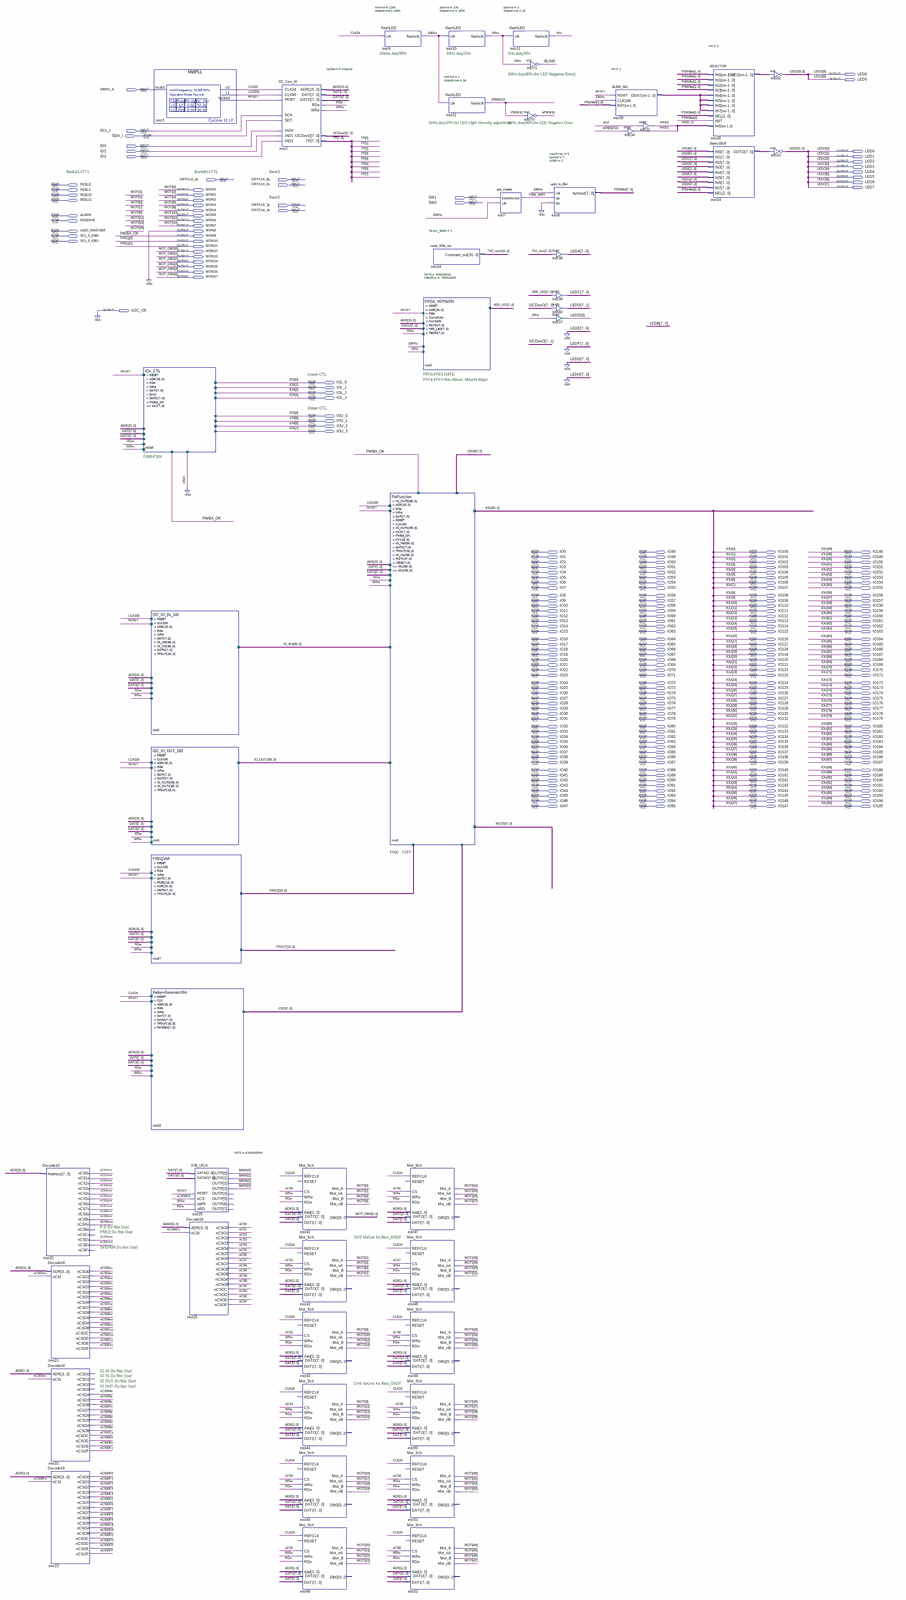
[diagram p0: schematic sheet, whole]
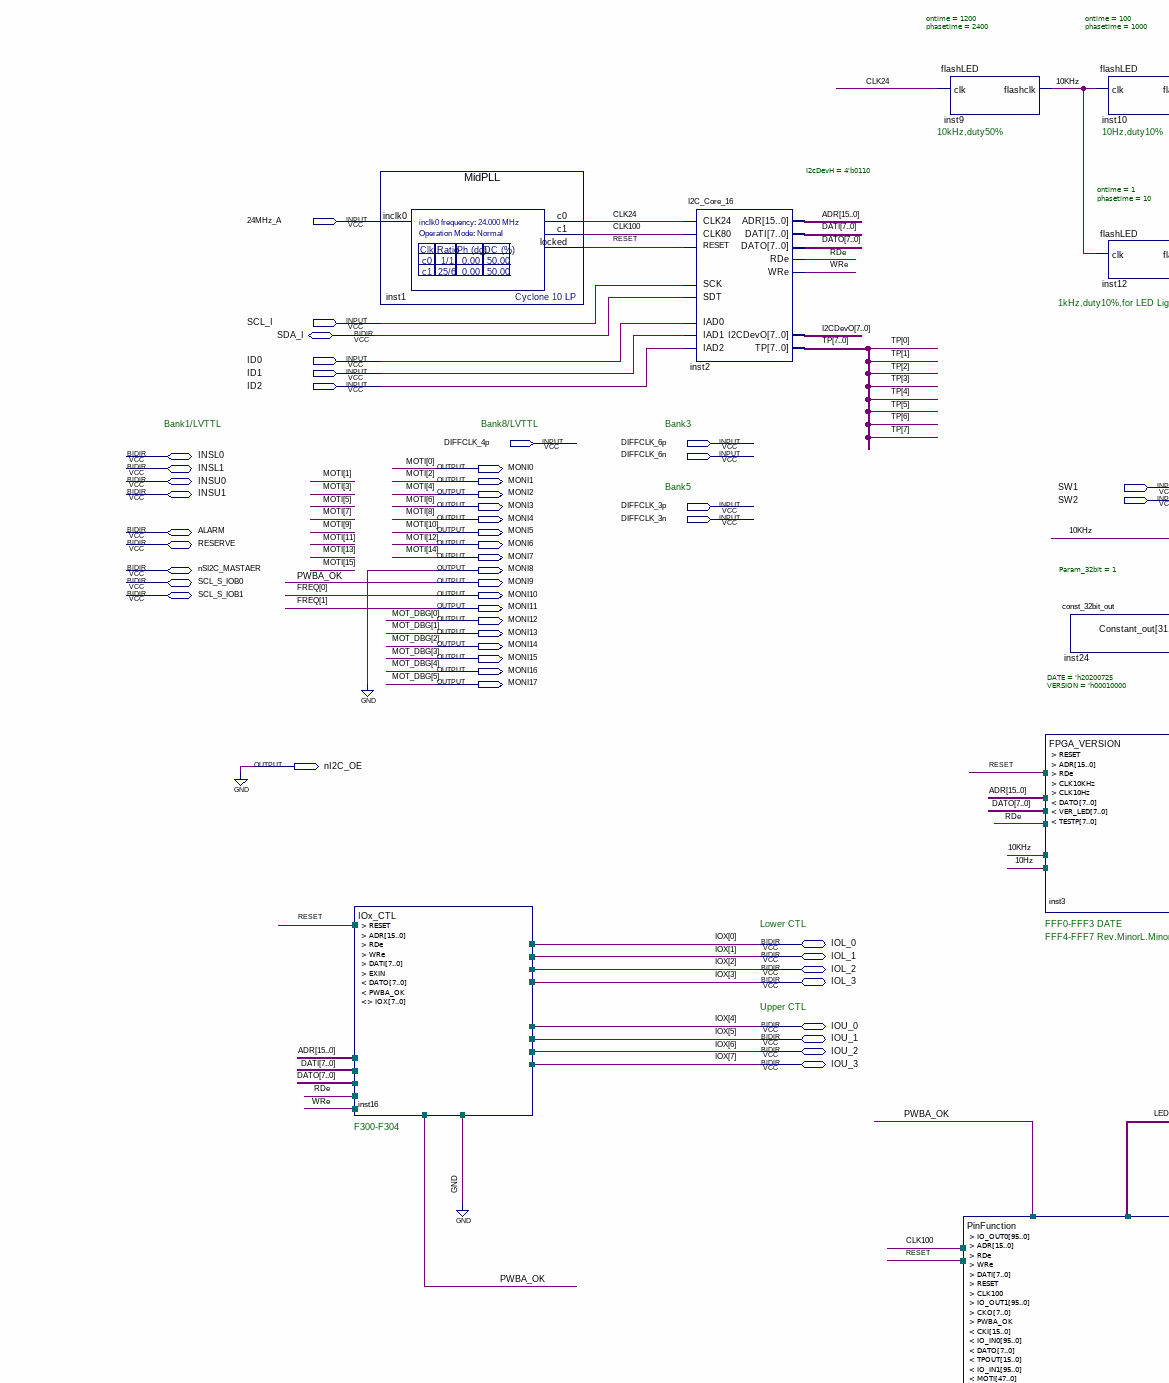
[diagram p1: schematic sheet, upper left part]
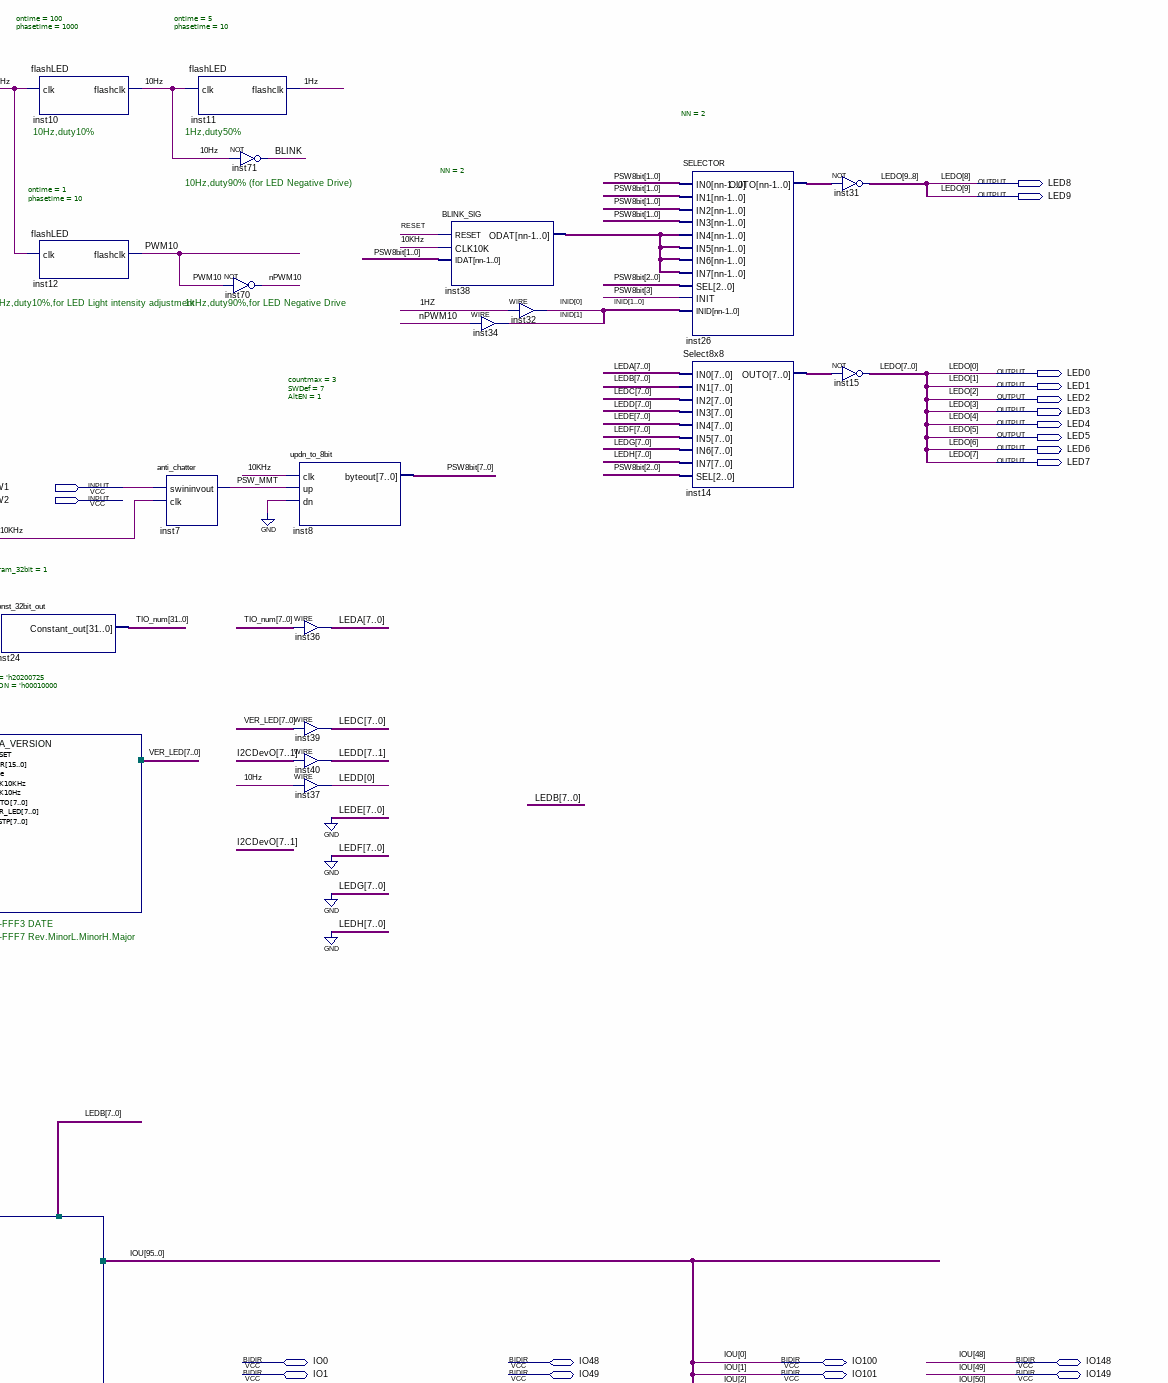
[diagram p2: schematic sheet, upper right part]
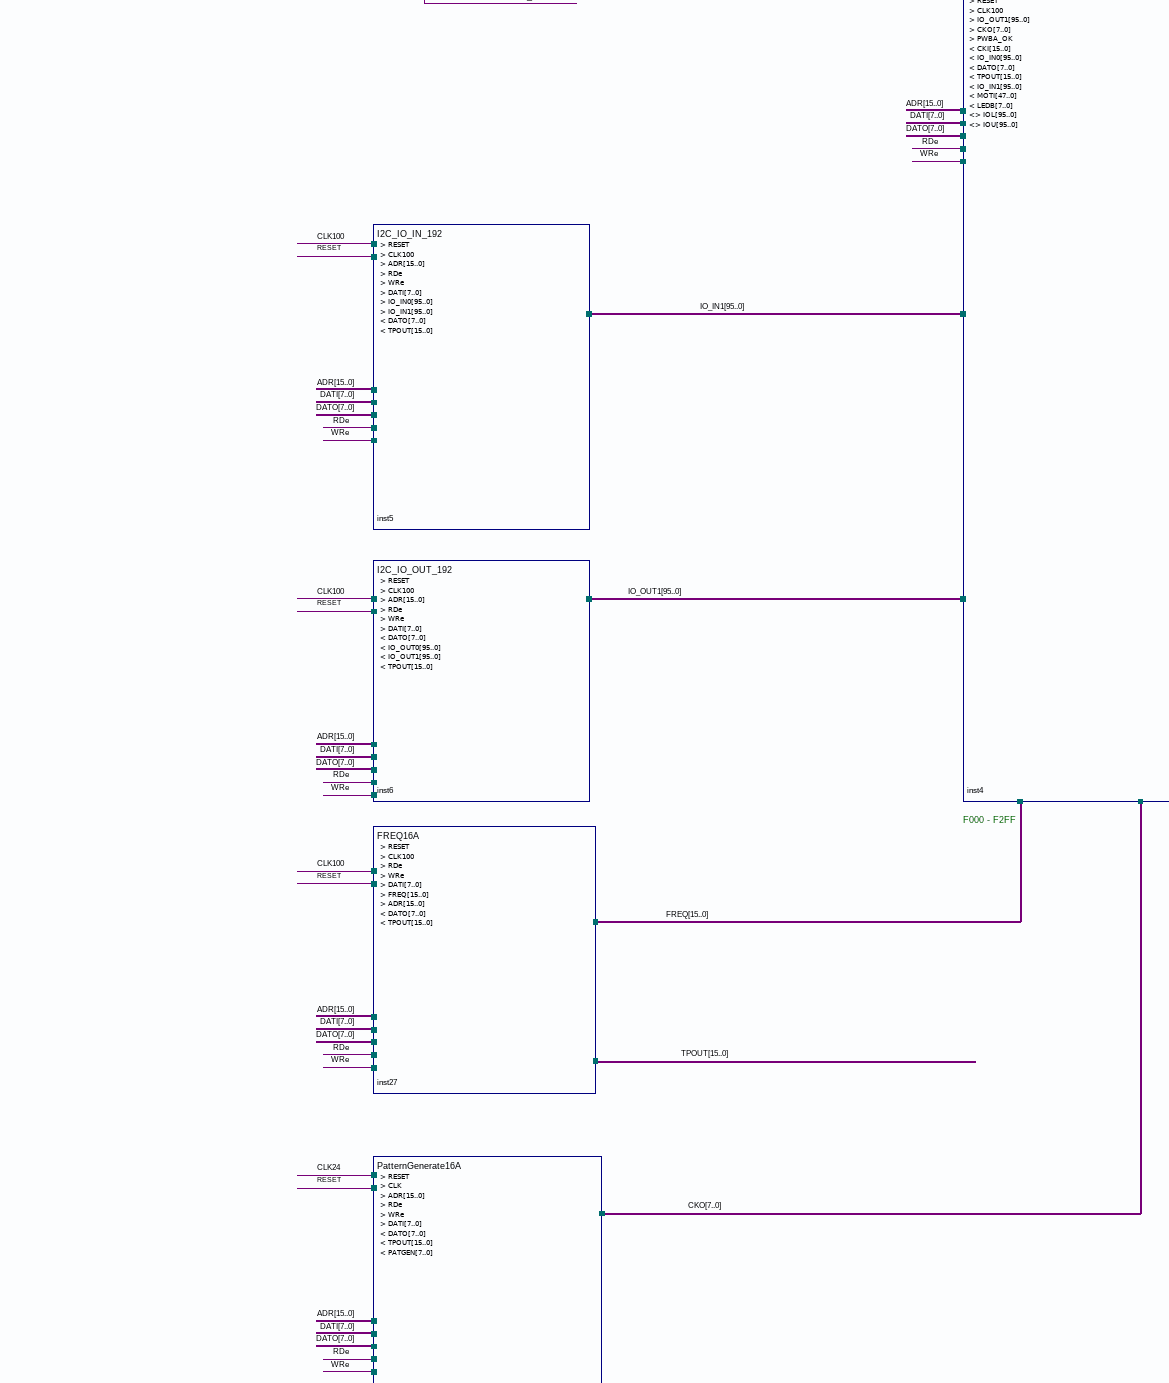
[diagram p3: schematic sheet, middle left part]
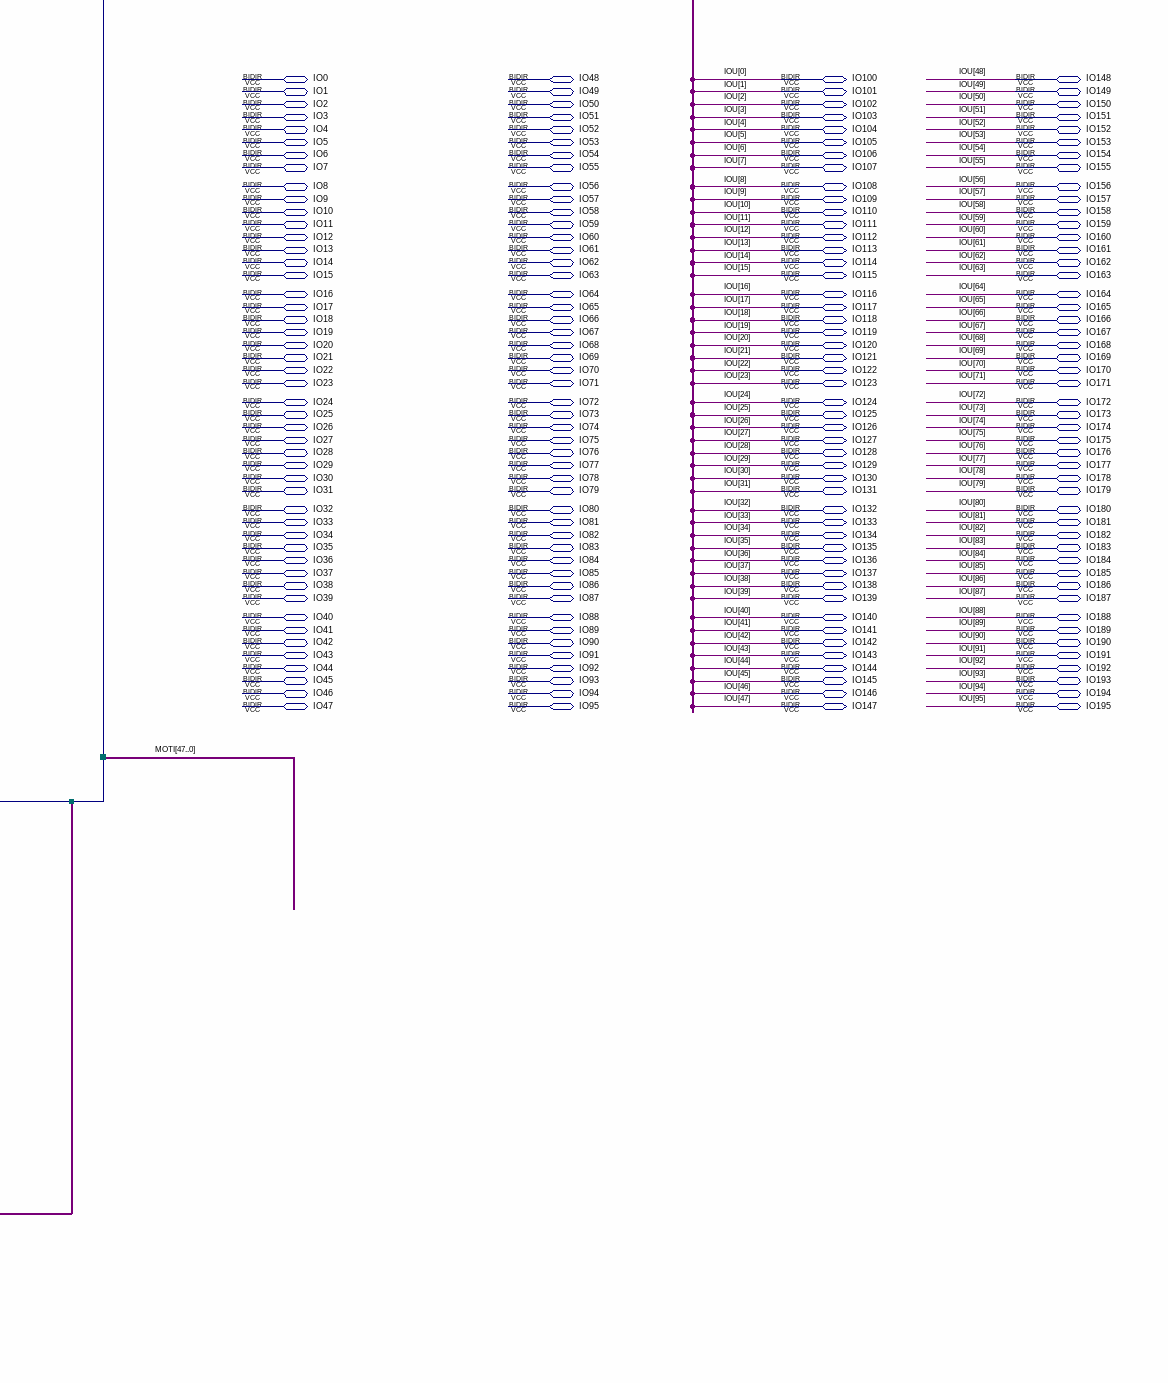
[diagram p4: schematic sheet, middle right part]
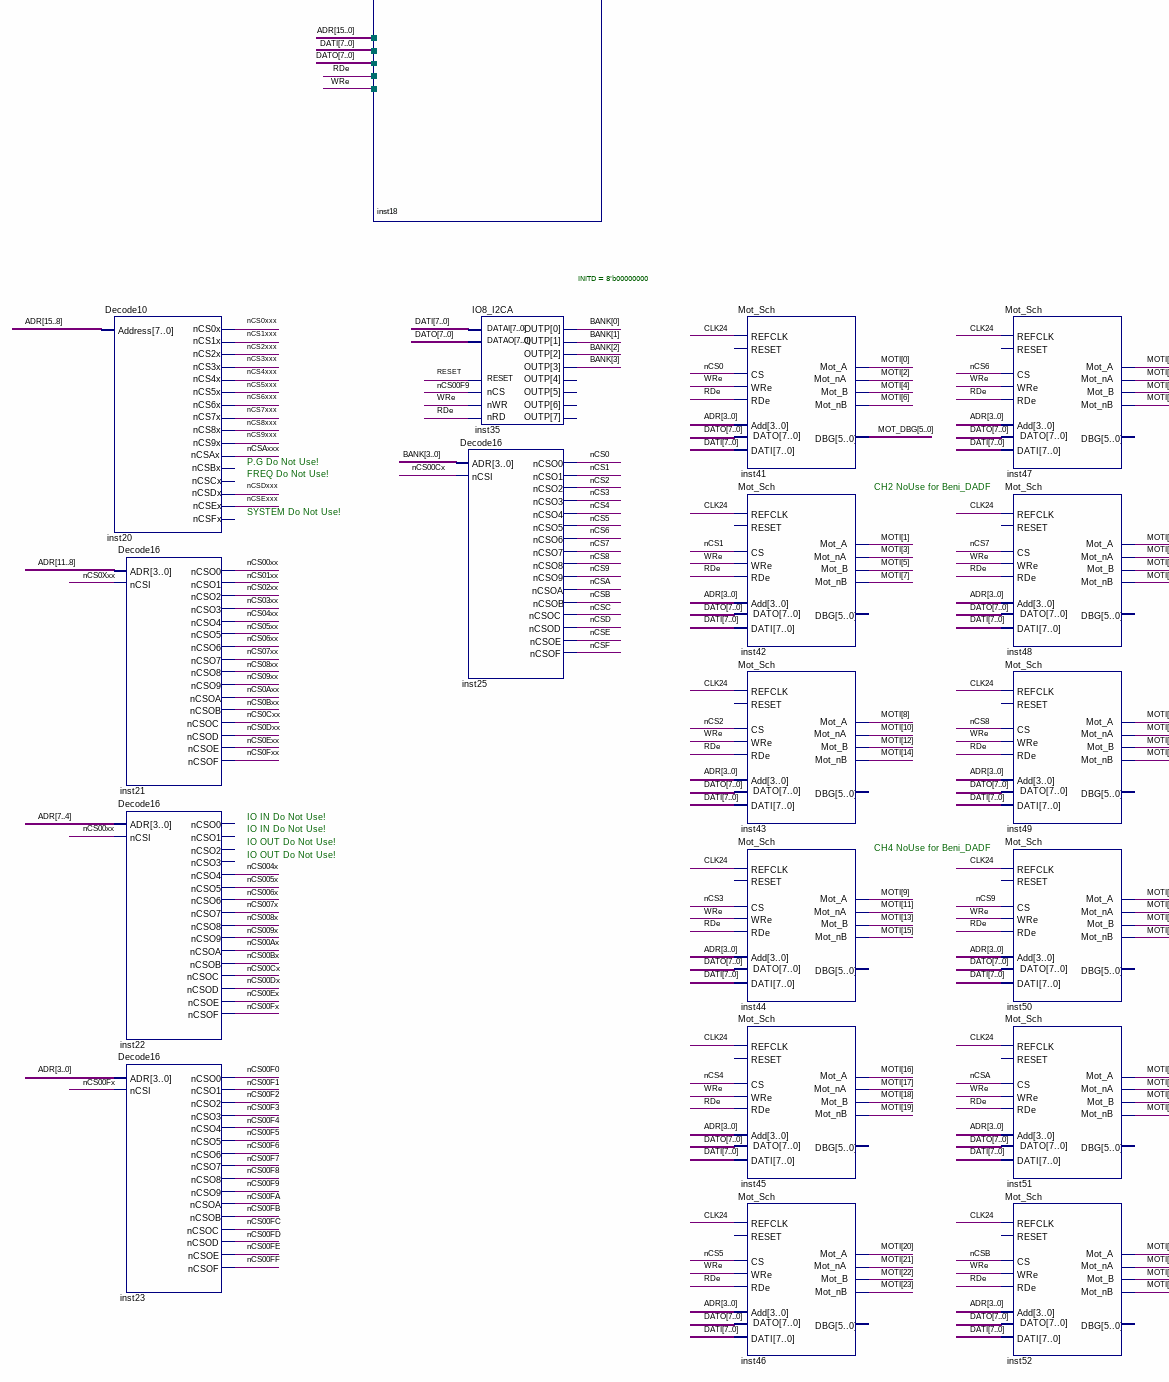
[diagram p5: schematic sheet, lower left part]
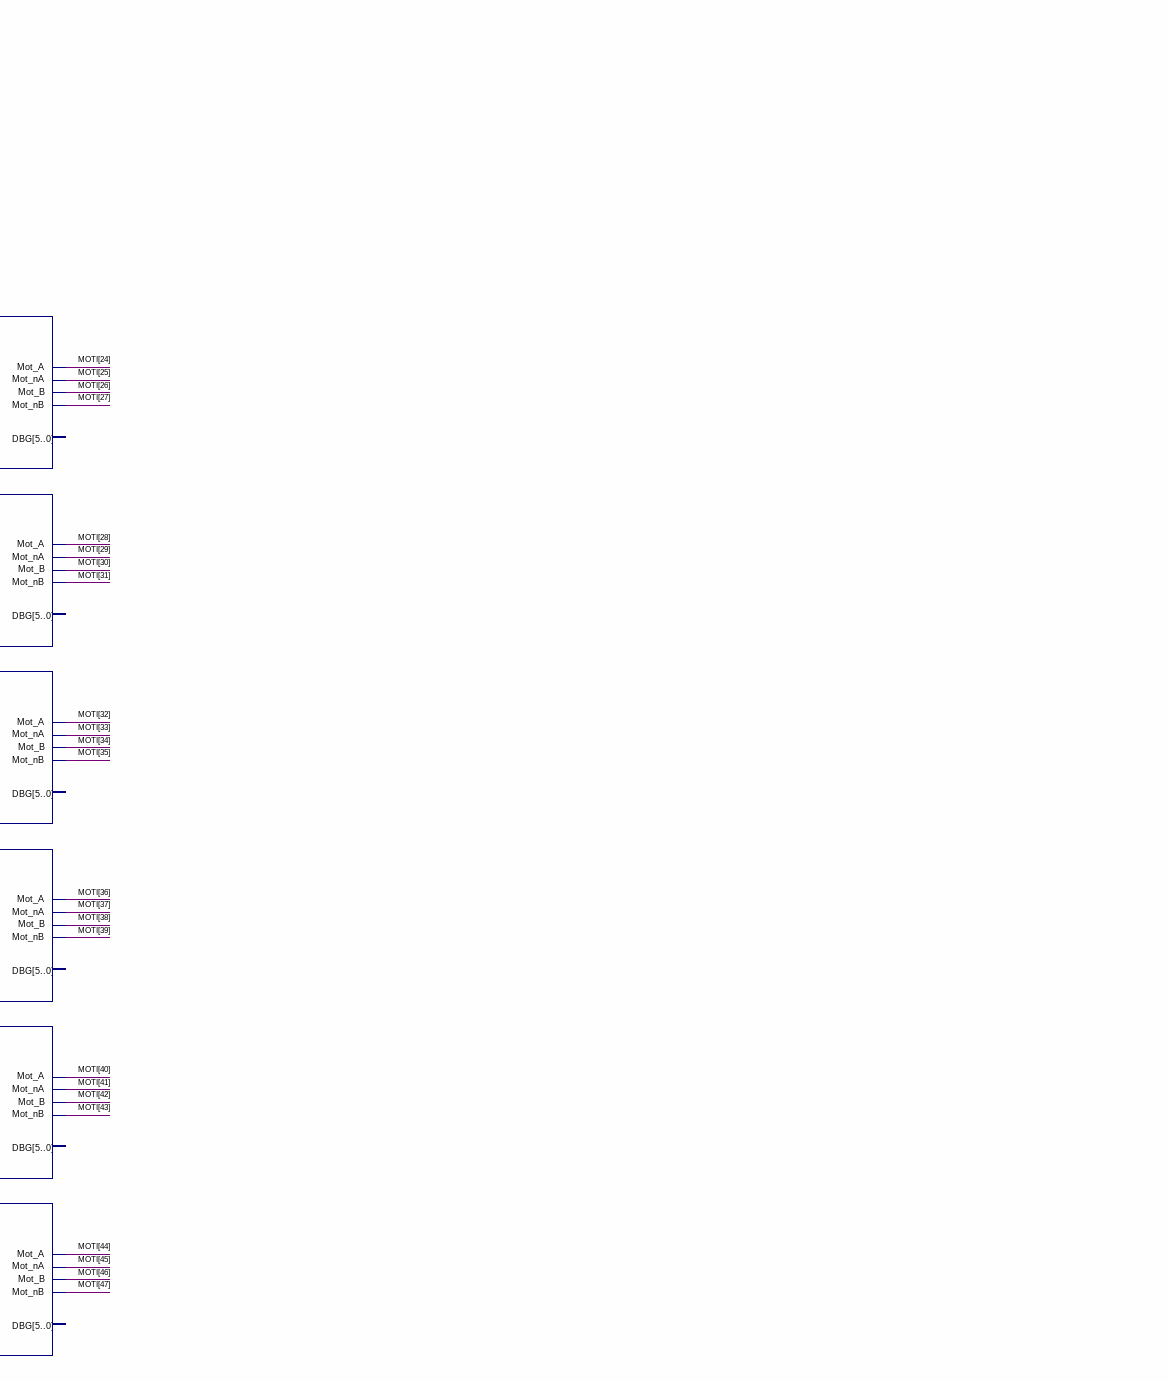
[diagram p6: schematic sheet, lower right part]
// Quartus schematic MID_TypeA.bdf as structural Verilog: 47 symbols, 251 pins
module MID_TypeA (
  input  \24MHz_A ,
  input  SCL_I,
  input  ID0,
  input  ID1,
  input  ID2,
  input  DIFFCLK_4p,
  input  DIFFCLK_6p,
  input  DIFFCLK_6n,
  input  SW1,
  input  SW2,
  input  DIFFCLK_3p,
  input  DIFFCLK_3n,
  inout  SDA_I,
  inout  INSL0,
  inout  INSL1,
  inout  INSU0,
  inout  INSU1,
  inout  ALARM,
  inout  RESERVE,
  inout  nSI2C_MASTAER,
  inout  SCL_S_IOB0,
  inout  SCL_S_IOB1,
  inout  IOL_0,
  inout  IOL_1,
  inout  IOL_2,
  inout  IOL_3,
  inout  IOU_0,
  inout  IOU_1,
  inout  IOU_2,
  inout  IOU_3,
  inout  IO0,
  inout  IO48,
  inout  IO100,
  inout  IO148,
  inout  IO1,
  inout  IO49,
  inout  IO101,
  inout  IO149,
  inout  IO2,
  inout  IO50,
  inout  IO102,
  inout  IO150,
  inout  IO3,
  inout  IO51,
  inout  IO103,
  inout  IO151,
  inout  IO4,
  inout  IO52,
  inout  IO104,
  inout  IO152,
  inout  IO5,
  inout  IO53,
  inout  IO105,
  inout  IO153,
  inout  IO6,
  inout  IO54,
  inout  IO106,
  inout  IO154,
  inout  IO7,
  inout  IO55,
  inout  IO107,
  inout  IO155,
  inout  IO8,
  inout  IO56,
  inout  IO108,
  inout  IO156,
  inout  IO9,
  inout  IO57,
  inout  IO109,
  inout  IO157,
  inout  IO10,
  inout  IO58,
  inout  IO110,
  inout  IO158,
  inout  IO11,
  inout  IO59,
  inout  IO111,
  inout  IO159,
  inout  IO12,
  inout  IO60,
  inout  IO112,
  inout  IO160,
  inout  IO13,
  inout  IO61,
  inout  IO113,
  inout  IO161,
  inout  IO14,
  inout  IO62,
  inout  IO114,
  inout  IO162,
  inout  IO15,
  inout  IO63,
  inout  IO115,
  inout  IO163,
  inout  IO16,
  inout  IO64,
  inout  IO116,
  inout  IO164,
  inout  IO17,
  inout  IO65,
  inout  IO117,
  inout  IO165,
  inout  IO18,
  inout  IO66,
  inout  IO118,
  inout  IO166,
  inout  IO19,
  inout  IO67,
  inout  IO119,
  inout  IO167,
  inout  IO20,
  inout  IO68,
  inout  IO120,
  inout  IO168,
  inout  IO21,
  inout  IO69,
  inout  IO121,
  inout  IO169,
  inout  IO22,
  inout  IO70,
  inout  IO122,
  inout  IO170,
  inout  IO23,
  inout  IO71,
  inout  IO123,
  inout  IO171,
  inout  IO24,
  inout  IO72,
  inout  IO124,
  inout  IO172,
  inout  IO25,
  inout  IO73,
  inout  IO125,
  inout  IO173,
  inout  IO26,
  inout  IO74,
  inout  IO126,
  inout  IO174,
  inout  IO27,
  inout  IO75,
  inout  IO127,
  inout  IO175,
  inout  IO28,
  inout  IO76,
  inout  IO128,
  inout  IO176,
  inout  IO29,
  inout  IO77,
  inout  IO129,
  inout  IO177,
  inout  IO30,
  inout  IO78,
  inout  IO130,
  inout  IO178,
  inout  IO31,
  inout  IO79,
  inout  IO131,
  inout  IO179,
  inout  IO32,
  inout  IO80,
  inout  IO132,
  inout  IO180,
  inout  IO33,
  inout  IO81,
  inout  IO133,
  inout  IO181,
  inout  IO34,
  inout  IO82,
  inout  IO134,
  inout  IO182,
  inout  IO35,
  inout  IO83,
  inout  IO135,
  inout  IO183,
  inout  IO36,
  inout  IO84,
  inout  IO136,
  inout  IO184,
  inout  IO37,
  inout  IO85,
  inout  IO137,
  inout  IO185,
  inout  IO38,
  inout  IO86,
  inout  IO138,
  inout  IO186,
  inout  IO39,
  inout  IO87,
  inout  IO139,
  inout  IO187,
  inout  IO40,
  inout  IO88,
  inout  IO140,
  inout  IO188,
  inout  IO41,
  inout  IO89,
  inout  IO141,
  inout  IO189,
  inout  IO42,
  inout  IO90,
  inout  IO142,
  inout  IO190,
  inout  IO43,
  inout  IO91,
  inout  IO143,
  inout  IO191,
  inout  IO44,
  inout  IO92,
  inout  IO144,
  inout  IO192,
  inout  IO45,
  inout  IO93,
  inout  IO145,
  inout  IO193,
  inout  IO46,
  inout  IO94,
  inout  IO146,
  inout  IO194,
  inout  IO47,
  inout  IO95,
  inout  IO147,
  inout  IO195,
  output LED8,
  output LED9,
  output LED0,
  output LED1,
  output LED2,
  output LED3,
  output LED4,
  output LED5,
  output LED6,
  output LED7,
  output MONI0,
  output MONI1,
  output MONI2,
  output MONI3,
  output MONI4,
  output MONI5,
  output MONI6,
  output MONI7,
  output MONI8,
  output MONI9,
  output MONI10,
  output MONI11,
  output MONI12,
  output MONI13,
  output MONI14,
  output MONI15,
  output MONI16,
  output MONI17,
  output nI2C_OE
);

  wire \1Hz , \10Hz , \10KHz , BLINK, CLK24, CLK100, nCS0, nCS00Ax, nCS0Axx, nCS00Bx, nCS0Bxx, nCS00Cx,
       nCS0Cxx, nCS00Dx, nCS0Dxx, nCS00Ex, nCS0Exx, nCS00F0, nCS00F1, nCS00F2, nCS00F3, nCS00F4, nCS00F5,
       nCS00F6, nCS00F7, nCS00F8, nCS00F9, nCS00FA, nCS00FB, nCS00FC, nCS00FD, nCS00FE, nCS00FF, nCS00Fx,
       nCS0Fxx, nCS00xx, nCS0xxx, nCS1, nCS01xx, nCS1xxx, nCS2, nCS02xx, nCS2xxx, nCS3, nCS03xx, nCS3xxx,
       nCS4, nCS004x, nCS04xx, nCS4xxx, nCS5, nCS005x, nCS05xx, nCS5xxx, nCS6, nCS006x, nCS06xx, nCS6xxx,
       nCS7, nCS007x, nCS07xx, nCS7xxx, nCS8, nCS008x, nCS08xx, nCS8xxx, nCS9, nCS009x, nCS09xx, nCS9xxx,
       nCSA, nCSAxxx, nCSB, nCSC, nCSD, nCSDxxx, nCSE, nCSExxx, nCSF, nPWM10, PSW_MMT, PWM10, RDe, RESET, WRe;
  wire [1:0] INID, inst26_outo, inst38_odat;
  wire [3:0] BANK;
  wire [7:0] CKO, DATI, DATO, I2CDevO, inst14_outo, LEDA, LEDB, LEDC, LEDD, PSW8bit, TP, VER_LED;
  wire [15:0] ADR, TPOUT;
  wire [15:2] FREQ;
  wire [31:0] TIO_num;
  wire [47:1] MOTI;
  wire [95:0] IO_IN1, IO_OUT1;
  wire [7:0] inst35_outp_open;  // unused outputs

  Decode10 inst20 (
    .Address(ADR[15:8]), .nCS8x(nCS8xxx), .nCS9x(nCS9xxx), .nCSAx(nCSAxxx), .nCSDx(nCSDxxx), .nCSEx(nCSExxx),
    .nCS0x(nCS0xxx), .nCS1x(nCS1xxx), .nCS2x(nCS2xxx), .nCS3x(nCS3xxx), .nCS4x(nCS4xxx), .nCS5x(nCS5xxx),
    .nCS6x(nCS6xxx), .nCS7x(nCS7xxx));  // open: nCSBx, nCSCx, nCSFx
  Decode16 inst21 (
    .ADR(ADR[11:8]), .nCSI(nCS0xxx), .nCSO0(nCS00xx), .nCSO1(nCS01xx), .nCSO2(nCS02xx), .nCSO3(nCS03xx),
    .nCSO4(nCS04xx), .nCSO5(nCS05xx), .nCSO6(nCS06xx), .nCSO7(nCS07xx), .nCSO8(nCS08xx), .nCSO9(nCS09xx),
    .nCSOA(nCS0Axx), .nCSOB(nCS0Bxx), .nCSOC(nCS0Cxx), .nCSOD(nCS0Dxx), .nCSOE(nCS0Exx), .nCSOF(nCS0Fxx));
  Decode16 inst22 (
    .ADR(ADR[7:4]), .nCSI(nCS00xx), .nCSO4(nCS004x), .nCSO5(nCS005x), .nCSO6(nCS006x), .nCSO7(nCS007x),
    .nCSO8(nCS008x), .nCSO9(nCS009x), .nCSOA(nCS00Ax), .nCSOB(nCS00Bx), .nCSOC(nCS00Cx), .nCSOD(nCS00Dx),
    .nCSOE(nCS00Ex), .nCSOF(nCS00Fx));  // open: nCSO0, nCSO1, nCSO2, nCSO3
  Decode16 inst23 (
    .ADR(ADR[3:0]), .nCSI(nCS00Fx), .nCSO0(nCS00F0), .nCSO1(nCS00F1), .nCSO2(nCS00F2), .nCSO3(nCS00F3),
    .nCSO4(nCS00F4), .nCSO5(nCS00F5), .nCSO6(nCS00F6), .nCSO7(nCS00F7), .nCSO8(nCS00F8), .nCSO9(nCS00F9),
    .nCSOA(nCS00FA), .nCSOB(nCS00FB), .nCSOC(nCS00FC), .nCSOD(nCS00FD), .nCSOE(nCS00FE), .nCSOF(nCS00FF));
  MidPLL inst1 (.inclk0(\24MHz_A ), .c0(CLK24), .c1(CLK100), .locked(RESET));
  IOx_CTL inst16 (
    .RESET(RESET), .ADR(ADR), .RDe(RDe), .WRe(WRe), .DATI(DATI), .EXIN(1'b0), .DATO(DATO), .PWBA_OK(MONI9));  // open: IOX
  I2C_IO_IN_192 inst5 (
    .RESET(RESET), .CLK100(CLK100), .ADR(ADR), .RDe(RDe), .WRe(WRe), .DATI(DATI), .IO_IN1(IO_IN1), .DATO(DATO));  // open: IO_IN0, TPOUT
  I2C_IO_OUT_192 inst6 (
    .RESET(RESET), .CLK100(CLK100), .ADR(ADR), .RDe(RDe), .WRe(WRe), .DATI(DATI), .DATO(DATO),
    .IO_OUT1(IO_OUT1));  // open: IO_OUT0, TPOUT
  FREQ16A inst27 (
    .RESET(RESET), .CLK100(CLK100), .RDe(RDe), .WRe(WRe), .DATI(DATI), .FREQ({FREQ, MONI11, MONI10}),
    .ADR(ADR), .DATO(DATO), .TPOUT(TPOUT));
  PatternGenerate16A inst18 (
    .RESET(RESET), .CLK(CLK24), .ADR(ADR), .RDe(RDe), .WRe(WRe), .DATI(DATI), .DATO(DATO), .PATGEN(CKO));  // open: TPOUT
  IO8_I2CA #(.INITD(8'b00000000)) inst35 (
    .DATAI(DATI), .nCS(nCS00F9), .nWR(WRe), .nRD(RDe), .RESET(RESET), .DATAO(DATO),
    .OUTP({inst35_outp_open[7:4], BANK}));
  Decode16 inst25 (
    .ADR(BANK), .nCSI(nCS00Cx), .nCSO0(nCS0), .nCSO1(nCS1), .nCSO2(nCS2), .nCSO3(nCS3), .nCSO4(nCS4),
    .nCSO5(nCS5), .nCSO6(nCS6), .nCSO7(nCS7), .nCSO8(nCS8), .nCSO9(nCS9), .nCSOA(nCSA), .nCSOB(nCSB),
    .nCSOC(nCSC), .nCSOD(nCSD), .nCSOE(nCSE), .nCSOF(nCSF));
  I2C_Core_16 #(.I2cDevH(4'b0110)) inst2 (
    .CLK80(CLK100), .CLK24(CLK24), .RESET(RESET), .SCK(SCL_I), .DATO(DATO), .IAD0(ID0), .IAD1(ID1),
    .IAD2(ID2), .TP(TP), .WRe(WRe), .RDe(RDe), .ADR(ADR), .DATI(DATI), .I2CDevO(I2CDevO), .SDT(SDA_I));
  Mot_Sch inst41 (
    .Add(ADR[3:0]), .DATI(DATI), .REFCLK(CLK24), .Mot_A(MONI0), .RDe(RDe), .CS(nCS0), .WRe(WRe),
    .Mot_nA(MONI1), .Mot_B(MONI2), .Mot_nB(MONI3), .DATO(DATO),
    .DBG({MONI17, MONI16, MONI15, MONI14, MONI13, MONI12}));  // open: RESET
  Mot_Sch inst42 (
    .Add(ADR[3:0]), .DATI(DATI), .REFCLK(CLK24), .Mot_A(MOTI[1]), .RDe(RDe), .CS(nCS1), .WRe(WRe),
    .Mot_nA(MOTI[3]), .Mot_B(MOTI[5]), .Mot_nB(MOTI[7]), .DATO(DATO));  // open: RESET, DBG
  Mot_Sch inst43 (
    .Add(ADR[3:0]), .DATI(DATI), .REFCLK(CLK24), .Mot_A(MONI4), .RDe(RDe), .CS(nCS2), .WRe(WRe),
    .Mot_nA(MONI5), .Mot_B(MONI6), .Mot_nB(MONI7), .DATO(DATO));  // open: RESET, DBG
  Mot_Sch inst44 (
    .Add(ADR[3:0]), .DATI(DATI), .REFCLK(CLK24), .Mot_A(MOTI[9]), .RDe(RDe), .CS(nCS3), .WRe(WRe),
    .Mot_nA(MOTI[11]), .Mot_B(MOTI[13]), .Mot_nB(MOTI[15]), .DATO(DATO));  // open: RESET, DBG
  Mot_Sch inst45 (
    .Add(ADR[3:0]), .DATI(DATI), .REFCLK(CLK24), .Mot_A(MOTI[16]), .RDe(RDe), .CS(nCS4), .WRe(WRe),
    .Mot_nA(MOTI[17]), .Mot_B(MOTI[18]), .Mot_nB(MOTI[19]), .DATO(DATO));  // open: RESET, DBG
  Mot_Sch inst46 (
    .Add(ADR[3:0]), .DATI(DATI), .REFCLK(CLK24), .Mot_A(MOTI[20]), .RDe(RDe), .CS(nCS5), .WRe(WRe),
    .Mot_nA(MOTI[21]), .Mot_B(MOTI[22]), .Mot_nB(MOTI[23]), .DATO(DATO));  // open: RESET, DBG
  flashLED #(.ontime(1200), .phasetime(2400)) inst9 (.clk(CLK24), .flashclk(\10KHz ));
  PinFunction inst4 (
    .ADR(ADR), .RDe(RDe), .WRe(WRe), .DATI(DATI), .RESET(RESET), .CLK100(CLK100), .IO_OUT1(IO_OUT1),
    .CKO(CKO), .PWBA_OK(MONI9), .CKI({FREQ, MONI11, MONI10}), .DATO(DATO), .IO_IN1(IO_IN1),
    .MOTI({MOTI[47:15], MONI7, MOTI[13], MONI6, MOTI[11], MONI5, MOTI[9], MONI4, MOTI[7], MONI3, MOTI[5], MONI2, MOTI[3], MONI1, MOTI[1], MONI0}),
    .LEDB(LEDB),
    .IOU({IO195, IO194, IO193, IO192, IO191, IO190, IO189, IO188, IO187, IO186, IO185, IO184, IO183, IO182, IO181, IO180, IO179, IO178, IO177, IO176, IO175, IO174, IO173, IO172, IO171, IO170, IO169, IO168, IO167, IO166, IO165, IO164, IO163, IO162, IO161, IO160, IO159, IO158, IO157, IO156, IO155, IO154, IO153, IO152, IO151, IO150, IO149, IO148, IO147, IO146, IO145, IO144, IO143, IO142, IO141, IO140, IO139, IO138, IO137, IO136, IO135, IO134, IO133, IO132, IO131, IO130, IO129, IO128, IO127, IO126, IO125, IO124, IO123, IO122, IO121, IO120, IO119, IO118, IO117, IO116, IO115, IO114, IO113, IO112, IO111, IO110, IO109, IO108, IO107, IO106, IO105, IO104, IO103, IO102, IO101, IO100}));  // open: IO_OUT0, IO_IN0, TPOUT, IOL
  Mot_Sch inst47 (
    .Add(ADR[3:0]), .DATI(DATI), .REFCLK(CLK24), .Mot_A(MOTI[24]), .RDe(RDe), .CS(nCS6), .WRe(WRe),
    .Mot_nA(MOTI[25]), .Mot_B(MOTI[26]), .Mot_nB(MOTI[27]), .DATO(DATO));  // open: RESET, DBG
  Mot_Sch inst48 (
    .Add(ADR[3:0]), .DATI(DATI), .REFCLK(CLK24), .Mot_A(MOTI[28]), .RDe(RDe), .CS(nCS7), .WRe(WRe),
    .Mot_nA(MOTI[29]), .Mot_B(MOTI[30]), .Mot_nB(MOTI[31]), .DATO(DATO));  // open: RESET, DBG
  Mot_Sch inst49 (
    .Add(ADR[3:0]), .DATI(DATI), .REFCLK(CLK24), .Mot_A(MOTI[32]), .RDe(RDe), .CS(nCS8), .WRe(WRe),
    .Mot_nA(MOTI[33]), .Mot_B(MOTI[34]), .Mot_nB(MOTI[35]), .DATO(DATO));  // open: RESET, DBG
  Mot_Sch inst50 (
    .Add(ADR[3:0]), .DATI(DATI), .REFCLK(CLK24), .Mot_A(MOTI[36]), .RDe(RDe), .CS(nCS9), .WRe(WRe),
    .Mot_nA(MOTI[37]), .Mot_B(MOTI[38]), .Mot_nB(MOTI[39]), .DATO(DATO));  // open: RESET, DBG
  Mot_Sch inst51 (
    .Add(ADR[3:0]), .DATI(DATI), .REFCLK(CLK24), .Mot_A(MOTI[40]), .RDe(RDe), .CS(nCSA), .WRe(WRe),
    .Mot_nA(MOTI[41]), .Mot_B(MOTI[42]), .Mot_nB(MOTI[43]), .DATO(DATO));  // open: RESET, DBG
  Mot_Sch inst52 (
    .Add(ADR[3:0]), .DATI(DATI), .REFCLK(CLK24), .Mot_A(MOTI[44]), .RDe(RDe), .CS(nCSB), .WRe(WRe),
    .Mot_nA(MOTI[45]), .Mot_B(MOTI[46]), .Mot_nB(MOTI[47]), .DATO(DATO));  // open: RESET, DBG
  FPGA_VERSION #(.DATE('h20200725), .VERSION('h00010000)) inst3 (
    .RESET(RESET), .ADR(ADR), .RDe(RDe), .CLK10KHz(\10KHz ), .CLK10Hz(\10Hz ), .DATO(DATO), .VER_LED(VER_LED));  // open: TESTP
  flashLED #(.ontime(100), .phasetime(1000)) inst10 (.clk(\10KHz ), .flashclk(\10Hz ));
  flashLED #(.ontime(1), .phasetime(10)) inst12 (.clk(\10KHz ), .flashclk(PWM10));
  const_32bit_out #(.Param_32bit(1)) inst24 (.Constant_out(TIO_num));
  flashLED #(.ontime(5), .phasetime(10)) inst11 (.clk(\10Hz ), .flashclk(\1Hz ));
  anti_chatter inst7 (.swin(SW1), .clk(\10KHz ), .invout(PSW_MMT));
  not inst71 (BLINK, \10Hz );
  not inst70 (nPWM10, PWM10);
  updn_to_8bit #(.countmax(3), .SWDef(7), .AltEN(1)) inst8 (.clk(\10KHz ), .up(PSW_MMT), .dn(1'b0), .byteout(PSW8bit));
  assign LEDA = TIO_num[7:0];  // WIRE inst36
  assign LEDC = VER_LED;  // WIRE inst39
  assign LEDD[7:1] = I2CDevO[7:1];  // WIRE inst40
  assign LEDD[0] = \10Hz ;  // WIRE inst37
  BLINK_SIG #(.NN(2)) inst38 (.RESET(RESET), .CLK10K(\10KHz ), .IDAT(PSW8bit[1:0]), .ODAT(inst38_odat));
  assign INID[1] = nPWM10;  // WIRE inst34
  assign INID[0] = \1Hz ;  // WIRE inst32
  SELECTOR #(.NN(2)) inst26 (
    .IN0(PSW8bit[1:0]), .IN1(PSW8bit[1:0]), .IN2(PSW8bit[1:0]), .IN3(PSW8bit[1:0]), .IN4(inst38_odat),
    .IN5(inst38_odat), .IN6(inst38_odat), .IN7(inst38_odat), .SEL(PSW8bit[2:0]), .INIT(PSW8bit[3]),
    .INID(INID), .OUTO(inst26_outo));
  Select8x8 inst14 (
    .IN0(LEDA), .IN1(LEDB), .IN2(LEDC), .IN3(LEDD), .IN4({8{1'b0}}), .IN5({8{1'b0}}), .IN6({8{1'b0}}),
    .IN7({8{1'b0}}), .SEL(PSW8bit[2:0]), .OUTO(inst14_outo));
  assign {LED9, LED8} = ~inst26_outo;  // NOT inst31, 2 bits wide
  assign {LED7, LED6, LED5, LED4, LED3, LED2, LED1, LED0} = ~inst14_outo;  // NOT inst15, 8 bits wide

  assign MONI8 = 1'b0;
  assign nI2C_OE = 1'b0;

  // Other names for the same wires on the sheet: FREQ[1:0] = {MONI11, MONI10};
  //   IOU[95:0] = {IO195, IO194, IO193, IO192, IO191, IO190, IO189, IO188, IO187, IO186, IO185, IO184, IO183, IO182, IO181, IO180, IO179, IO178, IO177, IO176, IO175, IO174, IO173, IO172, IO171, IO170, IO169, IO168, IO167, IO166, IO165, IO164, IO163, IO162, IO161, IO160, IO159, IO158, IO157, IO156, IO155, IO154, IO153, IO152, IO151, IO150, IO149, IO148, IO147, IO146, IO145, IO144, IO143, IO142, IO141, IO140, IO139, IO138, IO137, IO136, IO135, IO134, IO133, IO132, IO131, IO130, IO129, IO128, IO127, IO126, IO125, IO124, IO123, IO122, IO121, IO120, IO119, IO118, IO117, IO116, IO115, IO114, IO113, IO112, IO111, IO110, IO109, IO108, IO107, IO106, IO105, IO104, IO103, IO102, IO101, IO100};
  //   IOX[7:0] = {IOU_3, IOU_2, IOU_1, IOU_0, IOL_3, IOL_2, IOL_1, IOL_0};
  //   LEDO[9:0] = {LED9, LED8, LED7, LED6, LED5, LED4, LED3, LED2, LED1, LED0};
  //   MOT_DBG[5:0] = {MONI17, MONI16, MONI15, MONI14, MONI13, MONI12};
  //   MOTI (some bits) = {MONI7, MONI6, MONI5, MONI4, MONI3, MONI2, MONI1, MONI0}; PWBA_OK = MONI9

  // Notes on the sheet:
  //   10kHz,duty50%
  //   10Hz,duty10%
  //   1Hz,duty50%
  //   10Hz,duty90% (for LED Negative Drive)
  //   1kHz,duty10%,for LED Light intensity adjustment
  //   1kHz,duty90%,for LED Negative Drive
  //   Bank1/LVTTL
  //   Bank8/LVTTL
  //   Bank3
  //   Bank5
  //   Lower CTL
  //   FFF0-FFF3 DATE
  //   FFF4-FFF7 Rev.MinorL.MinorH.Major
  //   Upper CTL
  //   F300-F304
  //   F000 - F2FF
  //   P.G Do Not Use!
  //   FREQ Do Not Use!
  //   CH2 NoUse for Beni_DADF
  //   SYSTEM Do Not Use!
  //   IO IN Do Not Use!
  //   IO IN Do Not Use!
  //   IO OUT Do Not Use!
  //   CH4 NoUse for Beni_DADF
  //   IO OUT Do Not Use!
endmodule
